# Altium project TelemetryBoard.PrjPcb
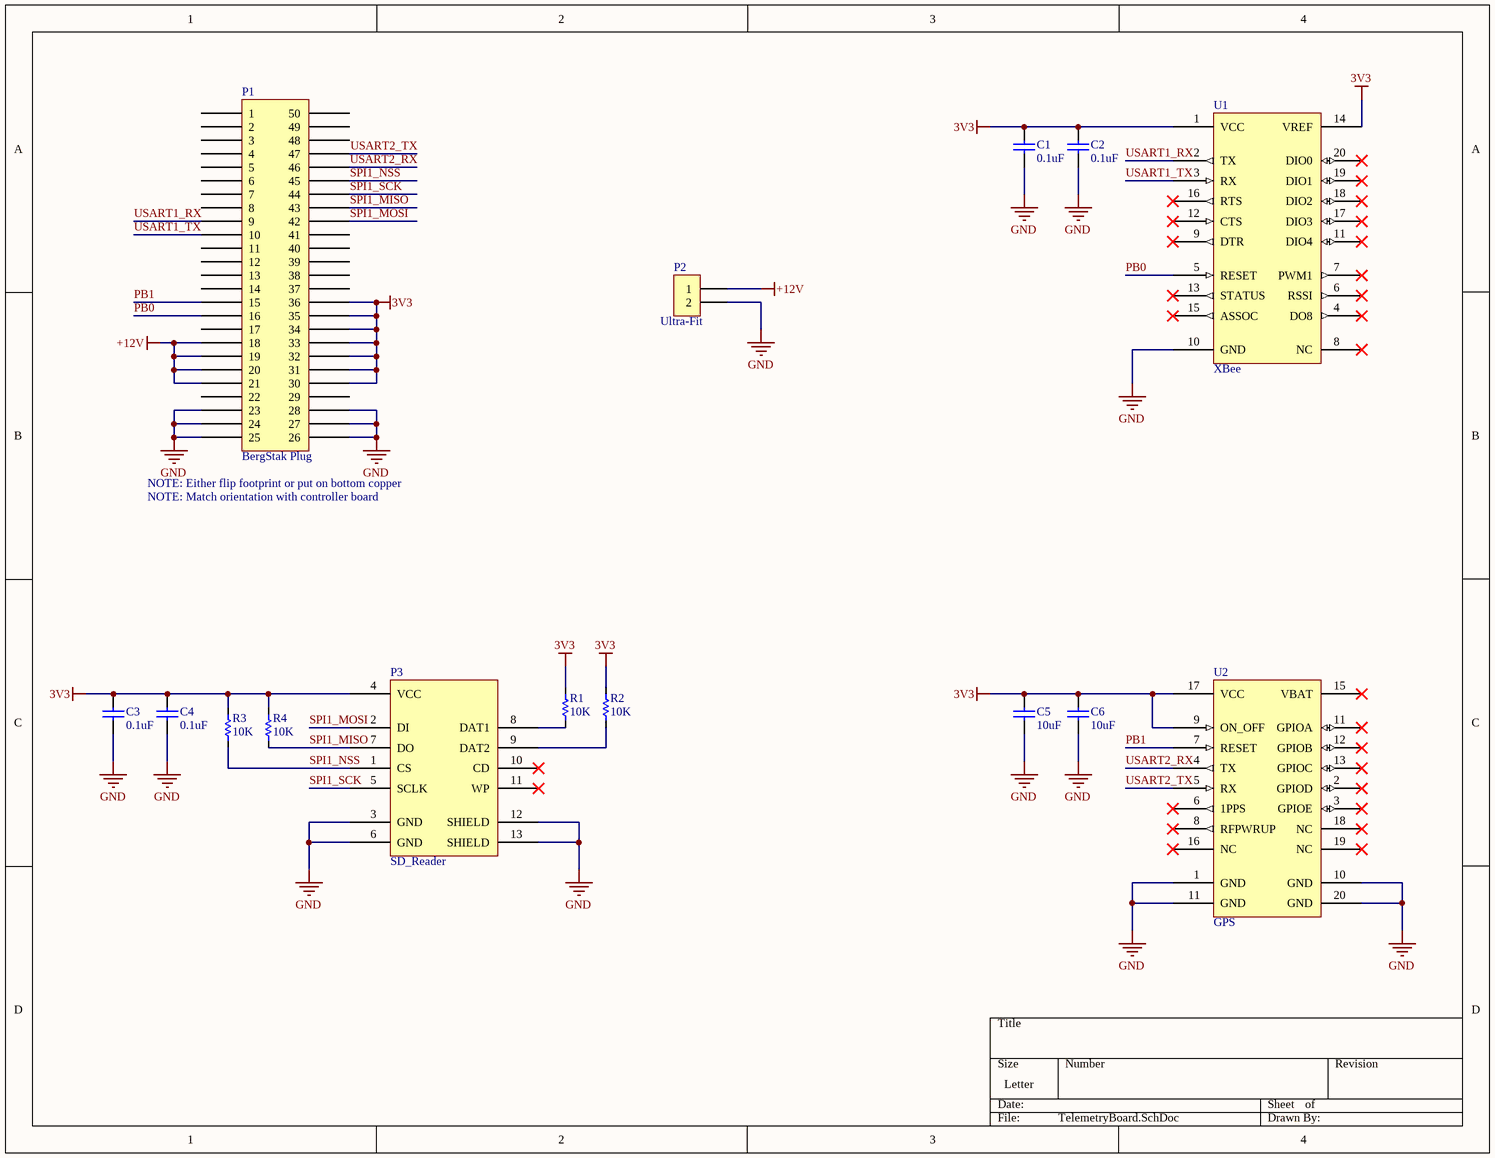
[diagram p0: TelemetryBoard.SchDoc]
1 sheet, 15 parts. Net scope: global (net labels, ports and power ports of the same name join across sheets).
Board file: TelemetryBoardPCB.PcbDoc

## Sheet TelemetryBoard.SchDoc
size Letter; PageSetup: Record=PageOptions|CenterHorizontal=True|CenterVertical=True|PrintScale=1.00|XCorrection=1.00|YCorrection=1.00|PrintKind=1|BorderSize=5000000|LeftOffset=0|BottomOffset=0|Orientation=2|PaperLength=1000|PaperWidth=1000|Scale=100|PaperSource=7|PrintQuality=-3|MediaType=1|DitherType=10|PrintScaleMode=1|PaperKind=Letter|PaperIndex=1

### Parts
C1  0.1uF  [0603]
C2  0.1uF  [0603]
C3  0.1uF  [0603]
C4  0.1uF  [0603]
C5  10uF  [0603]
C6  10uF  [0603]
P1  BergStak Plug  [609-5226-1-ND]
P2  Ultra-Fit  [WM11673-ND]
P3  SD_Reader  [SD_Reader]
R1  10K  [RES_0603]
R2  10K  [RES_0603]
R3  10K  [RES_0603]
R4  10K  [RES_0603]
U1  XBee  [XBee-PRO]
U2  GPS  [EVM-GPS-F4]

### Nets
3V3: C1.2 C2.2 C3.2 C4.2 C5.2 C6.2 P1.30 P1.31 P1.32 P1.33 P1.34 P1.35 P1.36 P3.4(VCC) R1.2 R2.2 R3.2 R4.2 U1.1(VCC) U1.14(VREF) U2.9(ON_OFF) U2.17(VCC)
+12V: P1.18 P1.19 P1.20 P1.21 P2.1
GND: C1.1 C2.1 C3.1 C4.1 C5.1 C6.1 P1.23 P1.24 P1.25 P1.26 P1.27 P1.28 P2.2 P3.3(GND) P3.6(GND) P3.12(SHIELD) P3.13(SHIELD) U1.10(GND) U2.1(GND) U2.10(GND) U2.11(GND) U2.20(GND)
PB0: P1.16 U1.5(RESET)
PB1: P1.15 U2.7(RESET)
SPI1_MISO: P1.43 P3.7(DO) R4.1
SPI1_MOSI: P1.42 P3.2(DI)
SPI1_NSS: P1.45 P3.1(CS) R3.1
SPI1_SCK: P1.44 P3.5(SCLK)
USART1_RX: P1.9 U1.2(TX)
USART1_TX: P1.10 U1.3(RX)
USART2_RX: P1.46 U2.4(TX)
USART2_TX: P1.47 U2.5(RX)
NetP3_8: P3.8(DAT1) R1.1
NetP3_9: P3.9(DAT2) R2.1

Not connected (* = marked no-connect by the designer): P1 1 2 3 4 5 6 7 8 11 12 13 14 17 22 29 37 38 39 40 41 48 49 50; P3 10(CD)* 11(WP)*; U1 4(DO8)* 6(RSSI)* 7(PWM1)* 8(NC)* 9(DTR)* 11(DIO4)* 12(CTS)* 13(STATUS)* 15(ASSOC)* 16(RTS)* 17(DIO3)* 18(DIO2)* 19(DIO1)* 20(DIO0)*; U2 2(GPIOD)* 3(GPIOE)* 6(1PPS)* 8(RFPWRUP)* 12(GPIOB)* 13(GPIOC)* 15(VBAT)* 16(NC)* 18(NC)* 19(NC)*

### Notes on the sheet
- (near P1) NOTE: Either flip footprint or put on bottom copper
- NOTE: Match orientation with controller board

### Library data of the parts
C1-C4 = CAP CER 0.1UF 50V 10% X7R 0603: 0.10µF ±10% 50V Ceramic Capacitor X7R 0603 (1608 Metric); Manufacturer: AVX Corporation; ManufacturerPartNumber: 06035C104KAT2A; Value: 0.1uF; Supplier: Digi-Key; SupplierPartNumber: 478-5052-1-ND; Supplier 1: Digi-Key
C5 C6 = CAP CER 10uF 25V 20% X5R 0603: 10µF ±20% 25V Ceramic Capacitor X5R 0603 (1608 Metric); Manufacturer: Murata Electronics North America; ManufacturerPartNumber: GRM188R61E106MA73D; Value: 10uF; Supplier: Digi-Key; SupplierPartNumber: 490-7202-1-ND; Supplier 1: Digi-Key
P1 = BergStak 50 Position Connector Plug: 50 Position Connector Plug, Outer Shroud Contacts Surface Mount Gold; Manufacturer PN: 10132797-055100LF; Digikey PN: 609-5226-1-ND
P2 = 2 Position Ultra-Fit Connector: 2 Positions Header, Shrouded Connector 0.138" (3.50mm) Through Hole Gold; Manufacturer PN: 1722861302; Digikey PN: WM11673-ND
P3 = SD_Reader: Manufacturer PN: 101-00313-68-02; Digikey PN: 101-00313-68-02CT-ND
R1-R4 = RES SMD 10K OHM 1% 1/10W 0603: Manufacture: Yageo; Manufacture Part Number: RC0603FR-0710KL; Vendor Part Number: 311-10.0KHRCT-ND; Vendor: Digi-Key; Tolerence: 1%; Power: 1/10W; Package: 0603; Supplier 1: Digi-Key; Supplier Part Number 1: 311-10.0KHRTR-ND; Value: 10K
U2 = GPS: GPS Module; Digikey PN: EVM-GPS-F4-ND; Manufacturer PN: EVM-GPS-F4